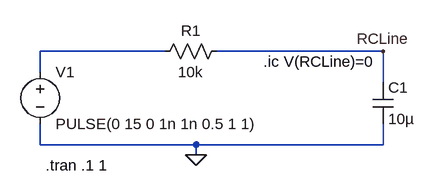
[diagram p0: schematic Carga condensador.asc]
Carga condensador.asc, the LTspice schematic file:
Version 4
SHEET 1 880 680
WIRE 240 128 48 128
WIRE 576 128 320 128
WIRE 48 160 48 128
WIRE 576 176 576 128
WIRE 48 272 48 240
WIRE 288 272 48 272
WIRE 576 272 576 240
WIRE 576 272 288 272
WIRE 288 288 288 272
FLAG 288 288 0
FLAG 576 128 RCLine
SYMBOL cap 560 176 R0
SYMATTR InstName C1
SYMATTR Value 10µ
SYMBOL res 224 144 R270
WINDOW 0 32 56 VTop 2
WINDOW 3 0 56 VBottom 2
SYMATTR InstName R1
SYMATTR Value 10k
SYMBOL voltage 48 144 R0
WINDOW 123 0 0 Left 0
WINDOW 39 0 0 Left 0
SYMATTR InstName V1
SYMATTR Value PULSE(0 15 0 1n 1n 0.5 1 1)
TEXT 392 144 Left 2 !.ic V(RCLine)=0
TEXT 56 304 Left 2 !.tran .1 1

The netlist it stands for:
* Carga condensador.asc
C1 RCLine 0 10µ
R1 N001 RCLine 10k
V1 N001 0 PULSE(0 15 0 1n 1n 0.5 1 1)
.ic V(RCLine)=0
.tran .1 1
.backanno
.end